# EAGLE design PowerIsoBoard_V1.2 (EAGLE 9.0.1)

## Sheet 1 of 4: Sensor dan power ISO
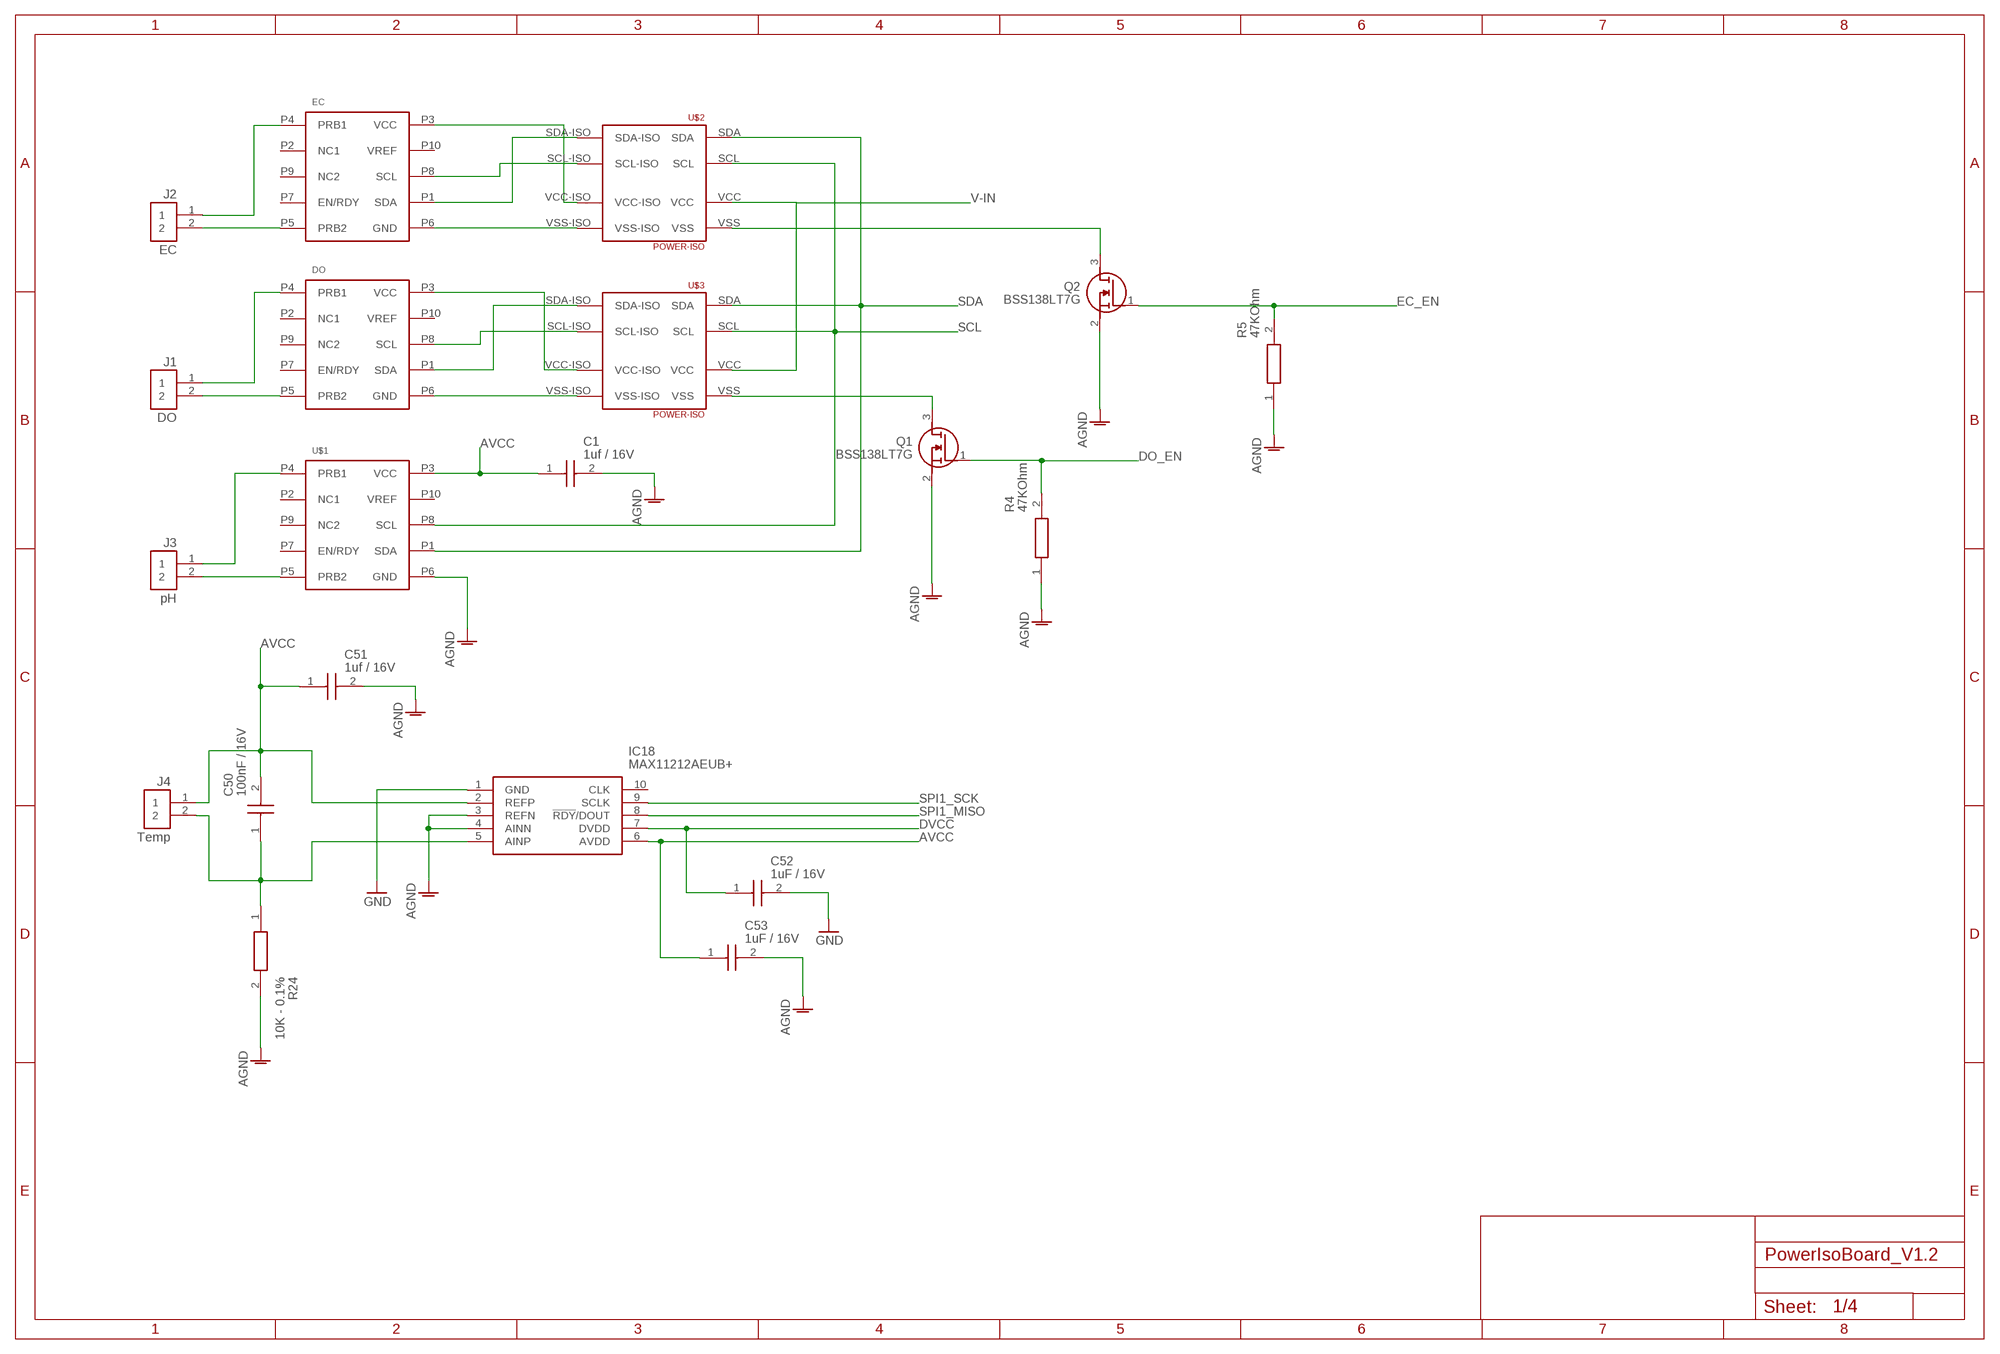
[diagram p0: schematic, sheet 1]

### Parts
C1  1uf / 16V  0603YC105JAT2A  [CAPC1608X90N]
C50  100nF / 16V  0603YC104JAT2A  [CAPC1608X90N]
C51  1uf / 16V  0603YC105JAT2A  [CAPC1608X90N]
C52  1uF / 16V  0603YC105JAT2A  [CAPC1608X90N]
C53  1uF / 16V  0603YC105JAT2A  [CAPC1608X90N]
DO  ATLAS-OEM-SMT  [EZO_SMT]
EC  ATLAS-OEM-SMT  [EZO_SMT]
IC18  MAX11212AEUB+  [SOP50P490X110-10N]
J1  DO  B2B-PH-K-S(LF)(SN)  [JST_B2B-PH-K-S(LF)(SN)]
J2  EC  B2B-PH-K-S(LF)(SN)  [JST_B2B-PH-K-S(LF)(SN)]
J3  pH  B2B-PH-K-S(LF)(SN)  [JST_B2B-PH-K-S(LF)(SN)]
J4  Temp  B2B-PH-K-S(LF)(SN)  [JST_B2B-PH-K-S(LF)(SN)]
Q1  BSS138LT7G  [SOT96P237X111-3N]
Q2  BSS138LT7G  [SOT96P237X111-3N]
R4  47KOhm  RC0603JR-1047KL  [RESC1608X55N]
R5  47KOhm  RC0603JR-1047KL  [RESC1608X55N]
R24  10K - 0.1%  ERA-3AEB103V  [RESC1608X55N]
U$1  ATLAS-OEM-SMT  [EZO_SMT]
U$2  POWER-ISO  [PWR_ISO_TH]
U$3  POWER-ISO  [PWR_ISO_TH]

### Nets
AGND: C1.2 Q1.2(S) Q2.2(S) R4.1 R5.1 U$1.P6(GND) ; also sheet 2
AVCC: C1.1 C50.2 C51.1 C53.1 IC18.2(REFP) IC18.6(AVDD) J4.1 U$1.P3(VCC) ; also sheet 2
DO_EN: Q1.1(G) R4.2 ; also sheet 3
DVCC: C52.1 IC18.7(DVDD) ; also sheet 2,3
EC_EN: Q2.1(G) R5.2 ; also sheet 3
GND: C51.2 C52.2 C53.2 IC18.1(GND) IC18.3(REFN) IC18.4(AINN) R24.2 ; supply symbol labelled AGND ; also sheet 2,3
N$1: C50.1 IC18.5(AINP) J4.2 R24.1
N$2: Q1.3(D) U$3.VSS
N$6: J3.2 U$1.P5(PRB2)
N$7: J3.1 U$1.P4(PRB1)
N$8: DO.P5(PRB2) J1.2
N$10: DO.P4(PRB1) J1.1
N$12: EC.P5(PRB2) J2.2
N$14: EC.P4(PRB1) J2.1
N$15: EC.P6(GND) U$2.VSS-ISO
N$16: EC.P3(VCC) U$2.VCC-ISO
N$17: EC.P8(SCL) U$2.SCL-ISO
N$18: EC.P1(SDA) U$2.SDA-ISO
N$19: DO.P6(GND) U$3.VSS-ISO
N$20: DO.P3(VCC) U$3.VCC-ISO
N$21: DO.P1(SDA) U$3.SDA-ISO
N$22: DO.P8(SCL) U$3.SCL-ISO
N$23: Q2.3(D) U$2.VSS
SCL: U$1.P8(SCL) U$2.SCL U$3.SCL ; also sheet 3
SDA: U$1.P1(SDA) U$2.SDA U$3.SDA ; also sheet 3
SPI1_MISO: IC18.8(!RDY!/DOUT) ; also sheet 3
SPI1_SCK: IC18.9(SCLK) ; also sheet 3
V-IN: U$2.VCC U$3.VCC ; also sheet 2,3
Unconnected: DO.P2(NC1) DO.P7(EN/RDY) DO.P9(NC2) DO.P10(VREF) EC.P2(NC1) EC.P7(EN/RDY) EC.P9(NC2) EC.P10(VREF) IC18.10(CLK) U$1.P2(NC1) U$1.P7(EN/RDY) U$1.P9(NC2) U$1.P10(VREF)

## Sheet 2 of 4: Regulator
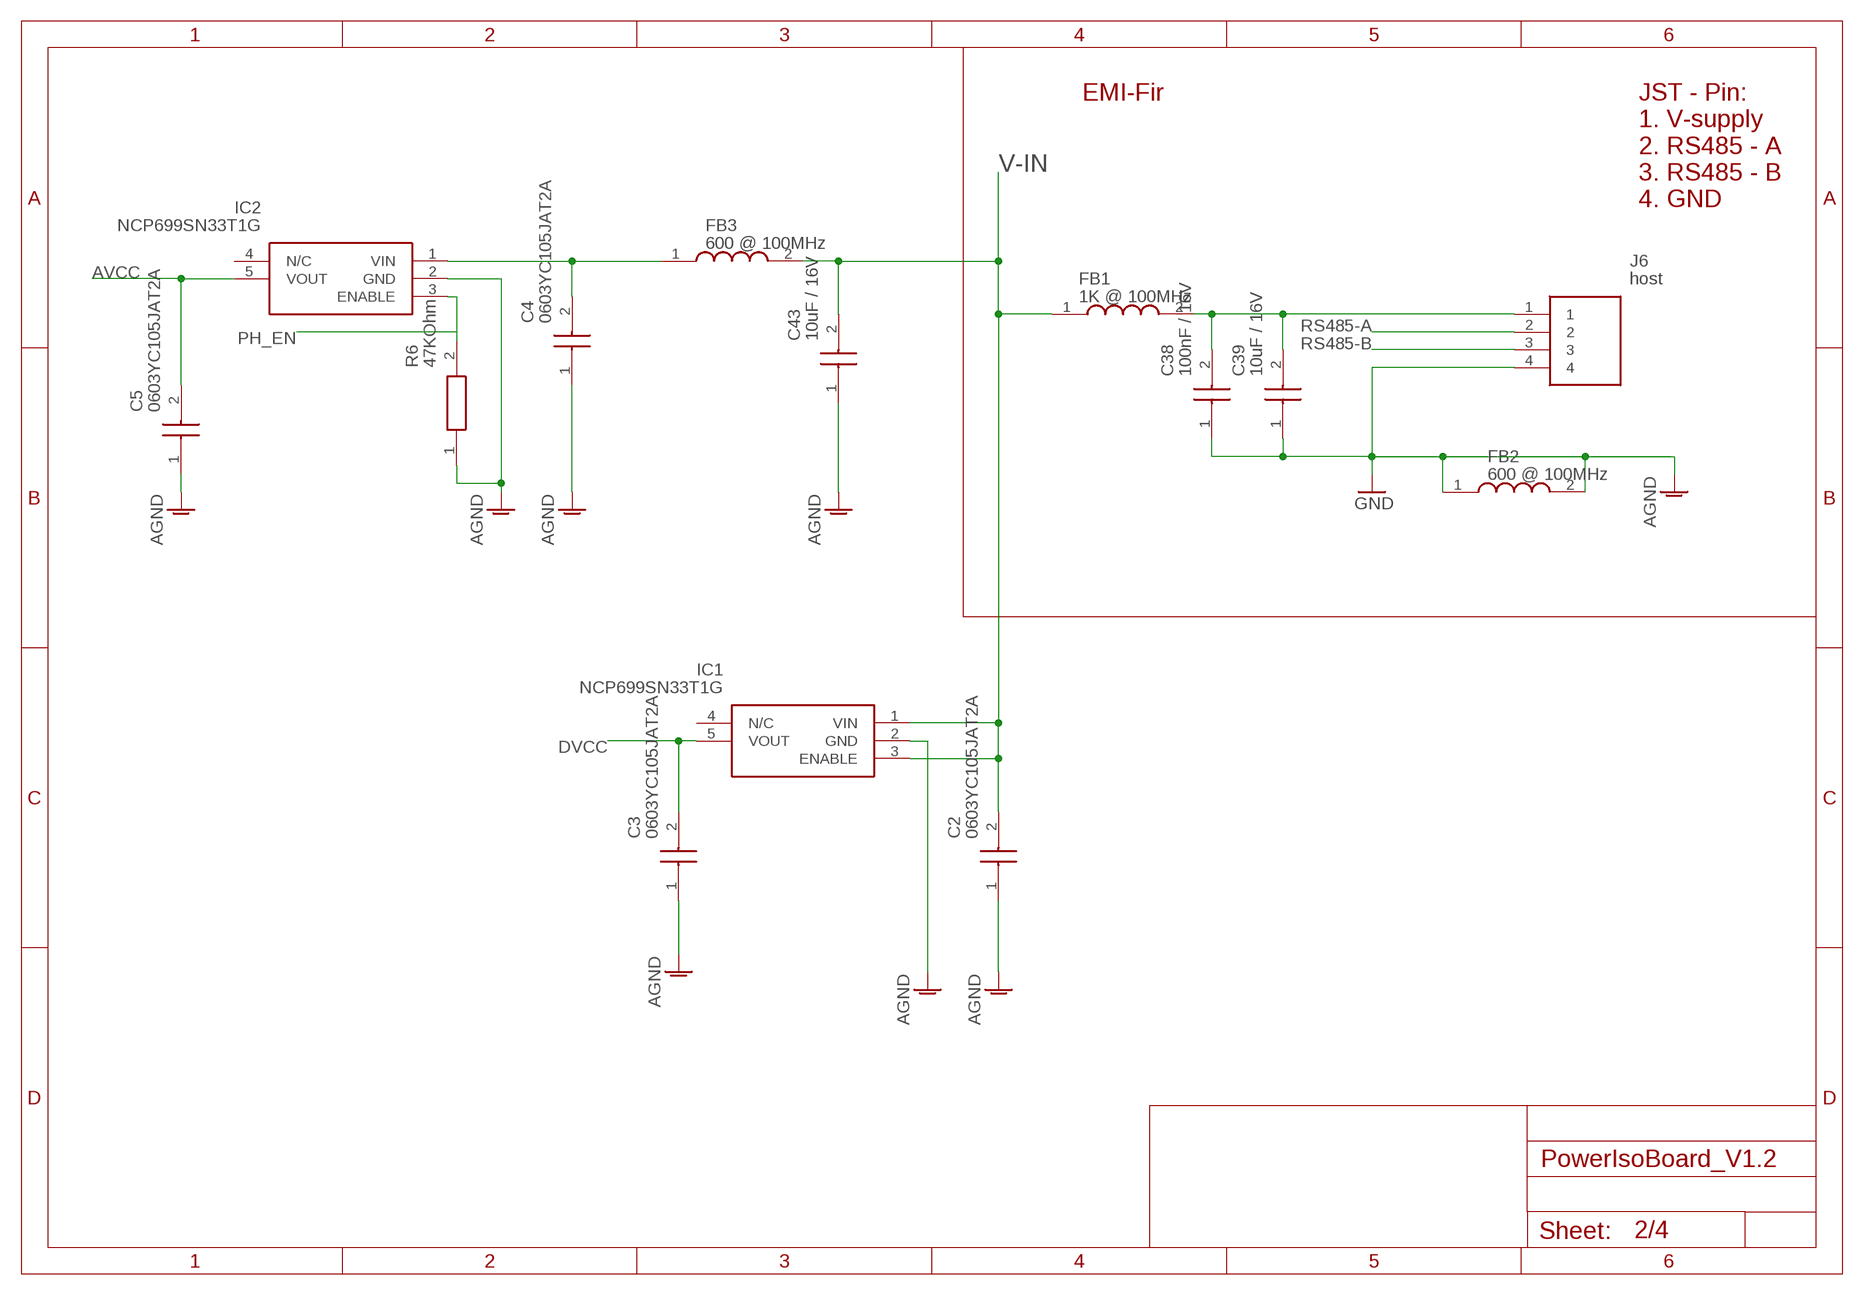
[diagram p1: schematic, sheet 2]

### Parts
C2  0603YC105JAT2A  [CAPC1608X90N]
C3  0603YC105JAT2A  [CAPC1608X90N]
C4  0603YC105JAT2A  [CAPC1608X90N]
C5  0603YC105JAT2A  [CAPC1608X90N]
C38  100nF / 16V  EMK107BJ104KAHT  [CAPC1608X90N]
C39  10uF / 16V  EMK107BBJ106MA-T  [CAPC1608X100N]
C43  10uF / 16V  EMK107BBJ106MA-T  [CAPC1608X100N]
FB1  1K @ 100MHz  BLM18KG102SH1D  [BLM18KG102SH1J]
FB2  600 @ 100MHz  MPZ1608S601ATA00  [BEADC1608X75N]
FB3  600 @ 100MHz  MPZ1608S601ATA00  [BEADC1608X75N]
IC1  NCP699SN33T1G  [SOT95P275X110-5N]
IC2  NCP699SN33T1G  [SOT95P275X110-5N]
J6  host  B4B-PH-K-S_LF__SN_  [SHDR4W50P0X200_1X4_990X450X600]
R6  47KOhm  RC0603JR-1047KL  [RESC1608X55N]

### Nets
AGND: C2.1 C3.1 C4.1 C5.1 C43.1 IC1.2(GND) IC2.2(GND) R6.1 ; also sheet 1
AVCC: C5.2 IC2.5(VOUT) ; also sheet 1
DVCC: C3.2 IC1.5(VOUT) ; also sheet 1,3
GND: C38.1 C39.1 FB2.1 FB2.2 J6.4 ; supply symbol labelled AGND ; also sheet 1,3
N$30: C38.2 C39.2 FB1.2 J6.1
N$31: C4.2 FB3.1 IC2.1(VIN)
PH_EN: IC2.3(ENABLE) R6.2 ; also sheet 3
RS485-A: J6.2 ; also sheet 3
RS485-B: J6.3 ; also sheet 3
V-IN: C2.2 C43.2 FB1.1 FB3.2 IC1.1(VIN) IC1.3(ENABLE) ; also sheet 1,3
Unconnected: IC1.4(N/C) IC2.4(N/C)

### Notes on the sheet
- EMI-Fir
- JST - Pin:
  1. V-supply
  2. RS485 - A
  3. RS485 - B
  4. GND

## Sheet 3 of 4
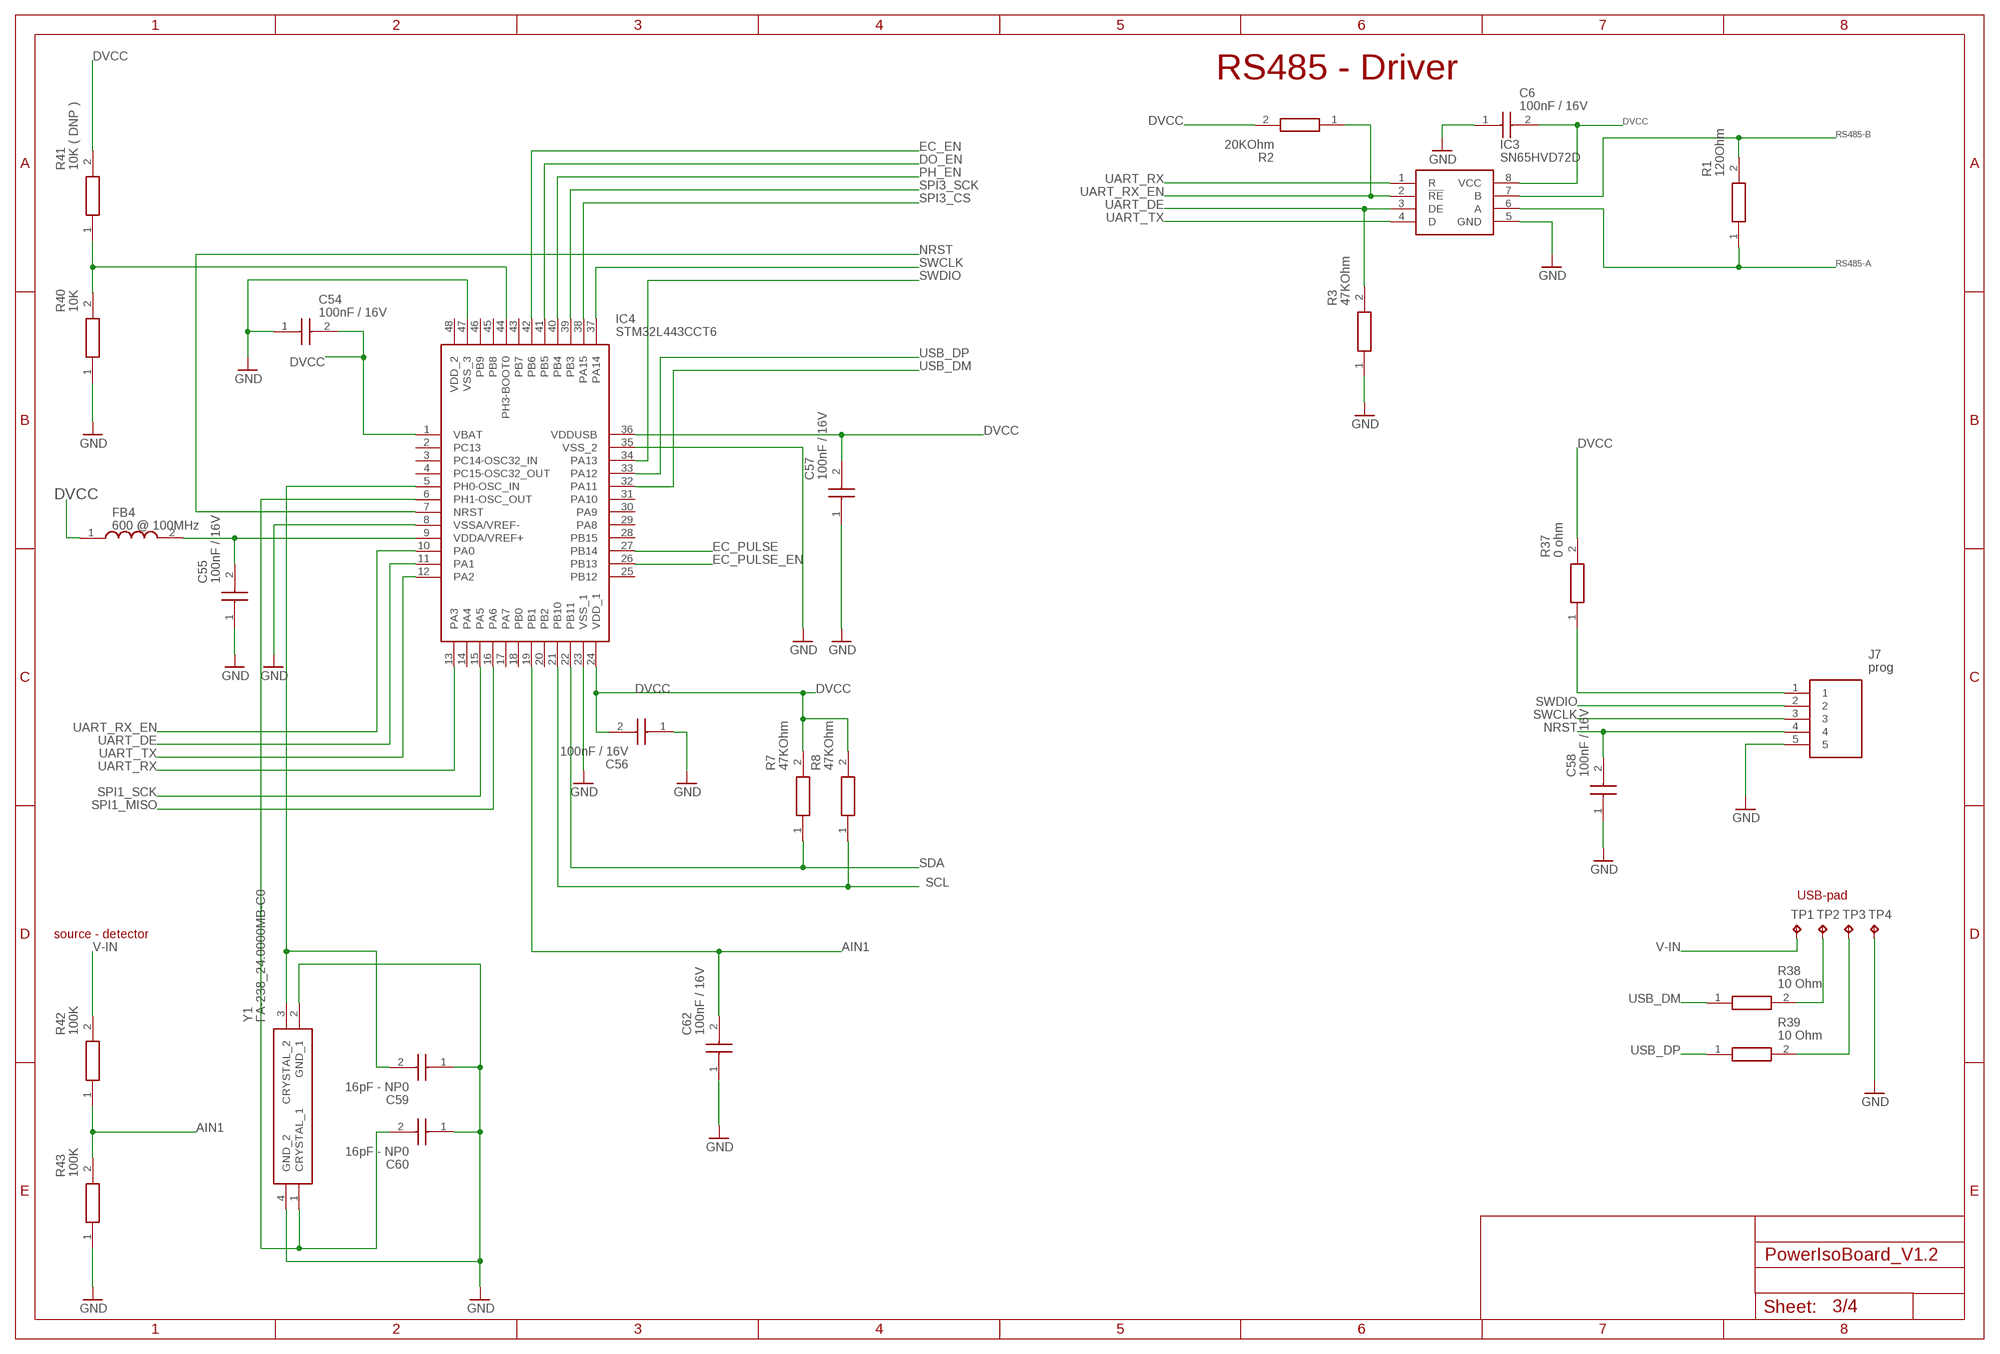
[diagram p2: schematic, sheet 3]

### Parts
C6  100nF / 16V  0603YC104JAT2A  [CAPC1608X90N]
C54  100nF / 16V  EMK107BJ104KAHT  [CAPC1608X90N]
C55  100nF / 16V  EMK107BJ104KAHT  [CAPC1608X90N]
C56  100nF / 16V  EMK107BJ104KAHT  [CAPC1608X90N]
C57  100nF / 16V  EMK107BJ104KAHT  [CAPC1608X90N]
C58  100nF / 16V  EMK107BJ104KAHT  [CAPC1608X90N]
C59  16pF - NP0  VJ0603A120KXCAC  [CAPC1608X97N]
C60  16pF - NP0  VJ0603A120KXCAC  [CAPC1608X97N]
C62  100nF / 16V  EMK107BJ104KAHT  [CAPC1608X90N]
FB4  600 @ 100MHz  MPZ1608S601ATA00  [BEADC1608X75N]
IC3  SN65HVD72D  [SOIC127P600X175-8N]
IC4  STM32L443CCT6  [QFP50P900X900X160-48N]
J7  prog  B5B-PH-K-S_LF__SN_  [SHDR5W50P0X200_1X5_1190X450X60]
R1  120Ohm  ERJ-3RBD1200V  [RESC1608X55N]
R2  20KOhm  ERA3AED203V  [RESC1608X55N]
R3  47KOhm  RC0603JR-1047KL  [RESC1608X55N]
R7  47KOhm  RC0603JR-1047KL  [RESC1608X55N]
R8  47KOhm  RC0603JR-1047KL  [RESC1608X55N]
R37  0 ohm  RC0603FR-070RL  [RESC1608X55N]
R38  10 Ohm  RT0603FRD0710RL  [RESC1608X55N]
R39  10 Ohm  RT0603FRD0710RL  [RESC1608X55N]
R40  10K  ERA-3AEB103V  [RESC1608X55N]
R41  10K ( DNP )  ERA-3AEB103V  [RESC1608X55N]
R42  100K  RT0603DRE07100KL  [RESC1608X55N]
R43  100K  RT0603DRE07100KL  [RESC1608X55N]
TP1  TPB1,27  [B1,27]
TP2  TPB1,27  [B1,27]
TP3  TPB1,27  [B1,27]
TP4  TPB1,27  [B1,27]
Y1  FA-238_24.0000MB-C0  [FA238240000MBC0]

### Nets
AIN1: C62.2 IC4.19(PB1) R42.1 R43.2
DO_EN: IC4.41(PB5) ; also sheet 1
DVCC: C6.2 C54.2 C56.2 C57.2 FB4.1 IC3.8(VCC) IC4.1(VBAT) IC4.24(VDD_1) IC4.36(VDDUSB) R2.2 R7.2 R8.2 R37.2 R41.2 ; also sheet 1,2
EC_EN: IC4.42(PB6) ; also sheet 1
EC_PULSE: IC4.27(PB14)
EC_PULSE_EN: IC4.26(PB13)
GND: C6.1 C54.1 C55.1 C56.1 C57.1 C58.1 C59.1 C60.1 C62.1 IC3.5(GND) IC4.8(VSSA/VREF-) IC4.23(VSS_1) IC4.35(VSS_2) IC4.47(VSS_3) J7.5 R3.1 R40.1 R43.1 TP4.TP Y1.2(GND_1) Y1.4(GND_2) ; also sheet 1,2
N$27: J7.1 R37.1
N$32: R38.2 TP2.TP
N$33: R39.2 TP3.TP
N$34: IC4.44(PH3-BOOT0) R40.2 R41.1
N$45: C60.2 IC4.6(PH1-OSC_OUT) Y1.1(CRYSTAL_1)
N$49: C59.2 IC4.5(PH0-OSC_IN) Y1.3(CRYSTAL_2)
N$52: C55.2 FB4.2 IC4.9(VDDA/VREF+)
NRST: C58.2 IC4.7(NRST) J7.4
PH_EN: IC4.40(PB4) ; also sheet 2
RS485-A: IC3.6(A) R1.1 ; also sheet 2
RS485-B: IC3.7(B) R1.2 ; also sheet 2
SCL: IC4.21(PB10) R8.1 ; also sheet 1
SDA: IC4.22(PB11) R7.1 ; also sheet 1
SPI1_MISO: IC4.16(PA6) ; also sheet 1
SPI1_SCK: IC4.15(PA5) ; also sheet 1
SPI3_CS: IC4.38(PA15)
SPI3_SCK: IC4.39(PB3)
SWCLK: IC4.37(PA14) J7.3
SWDIO: IC4.34(PA13) J7.2
UART_DE: IC3.3(DE) IC4.11(PA1) R3.2
UART_RX: IC3.1(R) IC4.13(PA3)
UART_RX_EN: IC3.2(!RE) IC4.10(PA0) R2.1
UART_TX: IC3.4(D) IC4.12(PA2)
USB_DM: IC4.32(PA11) R38.1
USB_DP: IC4.33(PA12) R39.1
V-IN: R42.2 TP1.TP ; also sheet 1,2
Unconnected: IC4.2(PC13) IC4.3(PC14-OSC32_IN) IC4.4(PC15-OSC32_OUT) IC4.14(PA4) IC4.17(PA7) IC4.18(PB0) IC4.20(PB2) IC4.25(PB12) IC4.28(PB15) IC4.29(PA8) IC4.30(PA9) IC4.31(PA10) IC4.43(PB7) IC4.45(PB8) IC4.46(PB9) IC4.48(VDD_2)

### Notes on the sheet
- RS485 - Driver
- USB-pad
- source - detector

## Sheet 4 of 4: Keterangan Update
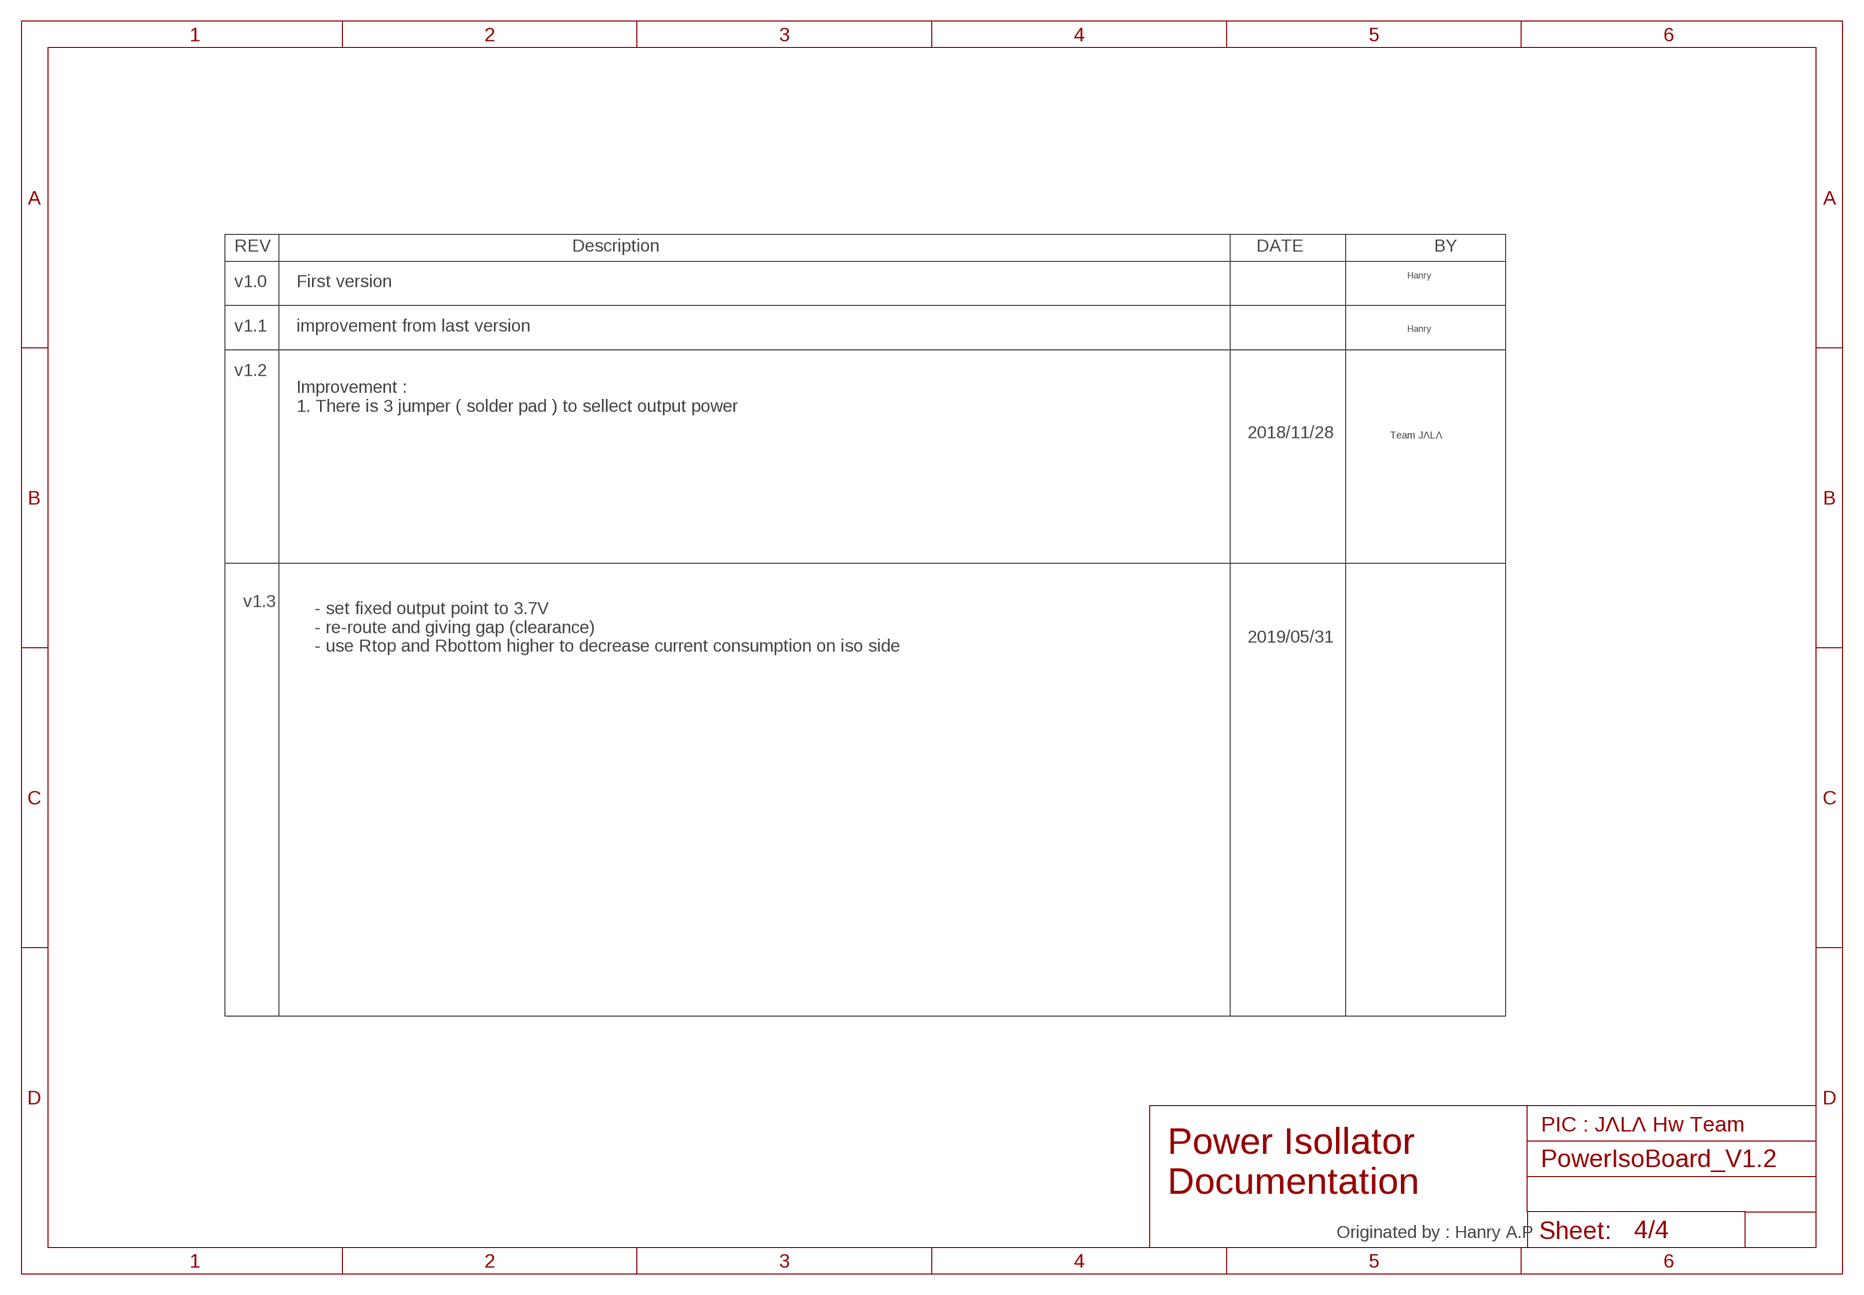
[diagram p3: schematic, sheet 4]

### Notes on the sheet
- Hanry
- v1.0 | First version
- v1.1 | improvement from last version | Hanry
- v1.2
- Improvement :
  1. There is 3 jumper ( solder pad ) to sellect output power
- 2018/11/28 | Team JΛLΛ
- v1.3
- 2019/05/31
- - set fixed output point to 3.7V
  - re-route and giving gap (clearance)
  - use Rtop and Rbottom higher to decrease current consumption on iso side
- PIC : JΛLΛ Hw Team
- Power Isollator
  Documentation
- Originated by : Hanry A.P

## Library data of the parts
C1-C5 C51-C53 = Samacsys:0603YC105JAT2A: Multilayer Ceramic Capacitors MLCC - SMD/SMT 16volts 1uF 5% X7R 0603 SIZE Source: Datasheet <http://www.mouser.com/catalog/supplier/library/pdf/AVXSurfaceMountCeramic.pdf>; ARROW_PART_NUMBER: 0603YC105JAT2A; ARROW_PRICE-STOCK: https://www.arrow.com/en/products/0603yc105jat2a/avx; DESCRIPTION: Multilayer Ceramic Capacitors MLCC - SMD/SMT 16volts 1uF 5% X7R 0603 SIZE; HEIGHT: 0.9mm; MANUFACTURER_NAME: AVX; MANUFACTURER_PART_NUMBER: 0603YC105JAT2A; MOUSER_PART_NUMBER: 581-0603YC105JAT2A; MOUSER_PRICE-STOCK: https://www.mouser.co.uk/ProductDetail/AVX/0603YC105JAT2A/?qs=RCLU9o6%252BptxSjO%252BNXwzoBQ%3D%3D
C6 C50 = Samacsys:0603YC104JAT2A: 0603 X7R ceramic capacitor, 100nF 16V AVX 0603 FlEXITERM 100nF Ceramic Multilayer Capacitor, 16 V dc X7R Dielectric ??5% SMD Source: Datasheet <http://datasheets.avx.com/X7RDielectric.pdf>; ARROW_PART_NUMBER: 0603YC104JAT2A; ARROW_PRICE-STOCK: https://www.arrow.com/en/products/0603yc104jat2a/avx; DESCRIPTION: 0603 X7R ceramic capacitor, 100nF 16V AVX 0603 FlEXITERM 100nF Ceramic Multilayer Capacitor, 16 V dc X7R Dielectric ??5% SMD; HEIGHT: 0.9mm; MANUFACTURER_NAME: AVX; MANUFACTURER_PART_NUMBER: 0603YC104JAT2A; MOUSER_PART_NUMBER: 581-0603YC104J; MOUSER_PRICE-STOCK: https://www.mouser.co.uk/ProductDetail/AVX/0603YC104JAT2A/?qs=sLCq1SyoLfFxJScN8MO4mA%3D%3D
C38 C54-C58 C62 = Samacsys:EMK107BJ104KAHT: Multilayer Ceramic Capacitors MLCC - SMD/SMT 0.1uF 16V X5R +/-10% 0603 AEC-Q200 Source: Datasheet <https://rs.componentsearchengine.com/Datasheets/1/EMK107BJ104KAHT.pdf>; DESCRIPTION: Multilayer Ceramic Capacitors MLCC - SMD/SMT 0.1uF 16V X5R +/-10% 0603 AEC-Q200; HEIGHT: 0.9mm; MANUFACTURER_NAME: TAIYO YUDEN; MANUFACTURER_PART_NUMBER: EMK107BJ104KAHT; MOUSER_PART_NUMBER: 963-EMK107BJ104KAHT; MOUSER_PRICE-STOCK: https://www.mouser.co.uk/ProductDetail/Taiyo-Yuden/EMK107BJ104KAHT?qs=CNQs48zzdnoELjxZCQMTEQ%3D%3D
C39 C43 = Samacsys:EMK107BBJ106MA-T: TAIYO YUDEN - EMK107BBJ106MA-T - CAPACITOR, MLCC, X5R, 10UF, 16V, 0603, REEL Source: Datasheet <https://altium.componentsearchengine.com/Datasheets/2/EMK107BBJ106MA-T.pdf>; DESCRIPTION: TAIYO YUDEN - EMK107BBJ106MA-T - CAPACITOR, MLCC, X5R, 10UF, 16V, 0603, REEL; HEIGHT: 1mm; MANUFACTURER_NAME: TAIYO YUDEN; MANUFACTURER_PART_NUMBER: EMK107BBJ106MA-T; MOUSER_PART_NUMBER: 963-EMK107BBJ106MA-T; MOUSER_PRICE-STOCK: https://www.mouser.co.uk/ProductDetail/Taiyo-Yuden/EMK107BBJ106MA-T?qs=%252BAZVS4b%2FkgLbAKVTp0R69Q%3D%3D
C59 C60 = Samacsys:VJ0603A120KXCAC: Multilayer Ceramic Capacitors MLCC - SMD/SMT Source: Datasheet <http://www.vishay.com/docs/45226/vj31xrohsautomlcc.pdf>; DESCRIPTION: Multilayer Ceramic Capacitors MLCC - SMD/SMT; HEIGHT: 0.97mm; MANUFACTURER_NAME: Vishay; MANUFACTURER_PART_NUMBER: VJ0603A120KXCAC; MOUSER_PART_NUMBER: N/A; MOUSER_PRICE-STOCK: https://www.mouser.co.uk/ProductDetail/Vishay-Vitramon/VJ0603A120KXCAC?qs=WQ%252BUh87gux%2F%2FnT6KKstV%252BA%3D%3D
DO EC U$1 = EZO:ATLAS-OEM-SMT; ATLAS-OEM: atlas-oem; ATLAS_OEM: Atlas - OEM
FB1 = Samacsys:BLM18KG102SH1D: BLM18_H1D Series EMI Suppression Filter 1000+/-25% at 100MHz 1A @85 Source: Datasheet <https://www.murata.com/en-us/products/productdetail?partno=BLM18KG102SH1#>; ARROW_PART_NUMBER: BLM18KG102SH1D; ARROW_PRICE-STOCK: https://www.arrow.com/en/products/blm18kg102sh1d/murata-manufacturing; DESCRIPTION: BLM18_H1D Series EMI Suppression Filter 1000+/-25% at 100MHz 1A @85; HEIGHT: 0.95mm; MANUFACTURER_NAME: Murata Electronics; MANUFACTURER_PART_NUMBER: BLM18KG102SH1D; MOUSER_PART_NUMBER: 81-BLM18KG102SH1D; MOUSER_PRICE-STOCK: https://www.mouser.co.uk/ProductDetail/Murata-Electronics/BLM18KG102SH1D?qs=0lQeLiL1qyYL39c9eT84hA%3D%3D
FB2-FB4 = Samacsys:MPZ1608S601ATA00: TDK - MPZ1608S601ATA00 - FERRITE BEAD, 0.15OHM, 1A, 0603 Source: Datasheet <https://componentsearchengine.com/Datasheets/2/MPZ1608S601ATA00.pdf>; ARROW_PART_NUMBER: MPZ1608S601ATA00; ARROW_PRICE-STOCK: https://www.arrow.com/en/products/mpz1608s601ata00/tdk; DESCRIPTION: TDK - MPZ1608S601ATA00 - FERRITE BEAD, 0.15OHM, 1A, 0603; HEIGHT: 0.75mm; MANUFACTURER_NAME: TDK; MANUFACTURER_PART_NUMBER: MPZ1608S601ATA00; MOUSER_PART_NUMBER: 810-MPZ1608S601ATA00; MOUSER_PRICE-STOCK: https://www.mouser.co.uk/ProductDetail/TDK/MPZ1608S601ATA00/?qs=47dIwT2ZIzth0CTKDYh9rw%3D%3D
IC1 IC2 = Samacsys:NCP699SN33T1G: ON SEMICONDUCTOR - NCP699SN33T1G - LDO VOLTAGE REGULATOR, 3.3V, 150mA, TSOP-5 Source: Datasheet <http://www.onsemi.com/pub/Collateral/NCP699-D.PDF>; ARROW_PART_NUMBER: NCP699SN33T1G; ARROW_PRICE-STOCK: https://www.arrow.com/en/products/ncp699sn33t1g/on-semiconductor; DESCRIPTION: ON SEMICONDUCTOR - NCP699SN33T1G - LDO VOLTAGE REGULATOR, 3.3V, 150mA, TSOP-5; HEIGHT: 1.1mm; MANUFACTURER_NAME: ON Semiconductor; MANUFACTURER_PART_NUMBER: NCP699SN33T1G; MOUSER_PART_NUMBER: 863-NCP699SN33T1G; MOUSER_PRICE-STOCK: https://www.mouser.co.uk/ProductDetail/ON-Semiconductor/NCP699SN33T1G?qs=mYaVSTb8pgUlwy5p82QNfw%3D%3D
IC3 = Samacsys:SN65HVD72D: 3.3 V Half-Duplex RS-485 with IEC ESD, 250 kbps Source: Datasheet <http://www.ti.com/lit/gpn/sn65hvd72>; ARROW_PART_NUMBER: SN65HVD72D; ARROW_PRICE-STOCK: https://www.arrow.com/en/products/sn65hvd72d/texas-instruments; DESCRIPTION: 3.3 V Half-Duplex RS-485 with IEC ESD, 250 kbps; HEIGHT: 1.75mm; MANUFACTURER_NAME: Texas Instruments; MANUFACTURER_PART_NUMBER: SN65HVD72D; MOUSER_PART_NUMBER: 595-SN65HVD72D; MOUSER_PRICE-STOCK: https://www.mouser.co.uk/ProductDetail/Texas-Instruments/SN65HVD72D/?qs=umApKWeh9pW%2FHHD2rvNVAg%3D%3D
IC4 = Samacsys:STM32L443CCT6: STMICROELECTRONICS - STM32L443CCT6 - ARM MCU, STM32 Family STM32L4 Series Microcontrollers, ARM Cortex-M4, 32bit, 80 MHz, 256 KB, 64 KB Source: Datasheet <https://componentsearchengine.com/Datasheets/2/STM32L443CCT6.pdf>; ARROW_PART_NUMBER: STM32L443CCT6; ARROW_PRICE-STOCK: https://www.arrow.com/en/products/stm32l443cct6/stmicroelectronics; DESCRIPTION: STMICROELECTRONICS - STM32L443CCT6 - ARM MCU, STM32 Family STM32L4 Series Microcontrollers, ARM Cortex-M4, 32bit, 80 MHz, 256 KB, 64 KB; HEIGHT: 1.6mm; MANUFACTURER_NAME: STMicroelectronics; MANUFACTURER_PART_NUMBER: STM32L443CCT6; MOUSER_PART_NUMBER: 511-STM32L443CCT6; MOUSER_PRICE-STOCK: https://www.mouser.co.uk/ProductDetail/STMicroelectronics/STM32L443CCT6/?qs=dTJS0cRn7ohLPtZ3IeJ%2Fbg%3D%3D
IC18 = Samacsys:MAX11212AEUB+: MAX11212AEUB+, 18 bit ADC Differential, Serial, 10-Pin uMAX Source: Datasheet <http://docs-emea.rs-online.com/webdocs/1253/0900766b812530b8.pdf>; DESCRIPTION: MAX11212AEUB+, 18 bit ADC Differential, Serial, 10-Pin uMAX; HEIGHT: 1.1mm; MANUFACTURER_NAME: Maxim Integrated; MANUFACTURER_PART_NUMBER: MAX11212AEUB+; MOUSER_PART_NUMBER: 700-MAX11212AEUB+; MOUSER_PRICE-STOCK: https://www.mouser.co.uk/ProductDetail/Maxim-Integrated/MAX11212AEUB%2b?qs=mzcOS1kGbgfUBSQ9RlyOlQ%3D%3D
J1-J4 = B2B-PH-K-S_LF__SN_:B2B-PH-K-S(LF)(SN): PH Series 2 Position 2 mm Pitch Through Hole Top Entry Shrouded Header Check prices <https://pricing.snapeda.com/parts/B2B-PH-K-S%28LF%29%28SN%29/JST%20Sales/view-part?ref=eda>; AVAILABILITY: Warning; DESCRIPTION: Connector Header Through Hole 2 position 0.079 (2.00mm); MF: JST Sales; MP: B2B-PH-K-S(LF)(SN); PACKAGE: None; PRICE: None
J6 = Samacsys:B4B-PH-K-S_LF__SN_: PH-2.0mm Header top entry 4 way JST PH Series, Series Number B4B, 2mm Pitch 4 Way 1 Row Straight PCB Header, Through Hole Termination, 2A Source: Datasheet <http://docs-emea.rs-online.com/webdocs/1347/0900766b81347511.pdf>; ARROW_PART_NUMBER: B4B-PH-K-S(LF)(SN); ARROW_PRICE-STOCK: https://www.arrow.com/en/products/b4b-ph-k-s-lf-sn/jst-manufacturing; DESCRIPTION: PH-2.0mm Header top entry 4 way JST PH Series, Series Number B4B, 2mm Pitch 4 Way 1 Row Straight PCB Header, Through Hole Termination, 2A; HEIGHT: 6mm; MANUFACTURER_NAME: JST (JAPAN SOLDERLESS TERMINALS); MANUFACTURER_PART_NUMBER: B4B-PH-K-S(LF)(SN)
J7 = Samacsys:B5B-PH-K-S_LF__SN_: PH-2.0mm Header top entry 5 way JST PH Series, Series Number B5B, 2mm Pitch 5 Way 1 Row Straight PCB Header, Through Hole Termination, 2A Source: Datasheet <http://uk.rs-online.com/web/p/products/8201438>; ARROW_PART_NUMBER: B5B-PH-K-S(LF)(SN); ARROW_PRICE-STOCK: https://www.arrow.com/en/products/b5b-ph-k-s-lf-sn/jst-manufacturing; DESCRIPTION: PH-2.0mm Header top entry 5 way JST PH Series, Series Number B5B, 2mm Pitch 5 Way 1 Row Straight PCB Header, Through Hole Termination, 2A; HEIGHT: 6mm; MANUFACTURER_NAME: JST (JAPAN SOLDERLESS TERMINALS); MANUFACTURER_PART_NUMBER: B5B-PH-K-S(LF)(SN)
Q1 Q2 = Samacsys:BSS138LT7G: MOSFET Single N-Channel Logic Level Power MOSFET 50V, 200mA, 3.5 Source: Datasheet <https://www.mouser.com/datasheet/2/308/BSS138LT1-D-1522521.pdf>; ARROW_PART_NUMBER: BSS138LT7G; ARROW_PRICE-STOCK: https://www.arrow.com/en/products/bss138lt7g/on-semiconductor; DESCRIPTION: MOSFET Single N-Channel Logic Level Power MOSFET 50V, 200mA, 3.5; HEIGHT: 1.11mm; MANUFACTURER_NAME: ON Semiconductor; MANUFACTURER_PART_NUMBER: BSS138LT7G; MOUSER_PART_NUMBER: 863-BSS138LT7G; MOUSER_PRICE-STOCK: https://www.mouser.co.uk/ProductDetail/ON-Semiconductor/BSS138LT7G/?qs=l7cgNqFNU1gVGpXKtqpwiw%3D%3D
R1 = Samacsys:ERJ-3RBD1200V: ERJ3R Resistor,0.1W,120 Ohms,0.5% Panasonic Thick Film Surface Mount Resistor 0603 Case 120 +/-0.5% 0.1W +/-50ppm/C Source: Datasheet <http://docs-europe.electrocomponents.com/webdocs/13ba/0900766b813ba21b.pdf>; DESCRIPTION: ERJ3R Resistor,0.1W,120 Ohms,0.5% Panasonic Thick Film Surface Mount Resistor 0603 Case 120 +/-0.5% 0.1W +/-50ppm/C; HEIGHT: 0.55mm; MANUFACTURER_NAME: Panasonic; MANUFACTURER_PART_NUMBER: ERJ-3RBD1200V; MOUSER_PART_NUMBER: 667-ERJ-3RBD1200V; MOUSER_PRICE-STOCK: https://www.mouser.co.uk/ProductDetail/Panasonic/ERJ-3RBD1200V/?qs=KTDjhDDUMAn3RR1z5n7W4A%3D%3D
R2 = Samacsys:ERA3AED203V: Metal Film (Thin Film) Chip Resistor 0603 203 Source: Datasheet <https://industrial.panasonic.com/cdbs/www-data/pdf/RDM0000/AOA0000C307.pdf>; ARROW_PART_NUMBER: ERA3AED203V; ARROW_PRICE-STOCK: https://www.arrow.com/en/products/era-3aed203v/panasonic; DESCRIPTION: Metal Film (Thin Film) Chip Resistor 0603 203; HEIGHT: 0.55mm; MANUFACTURER_NAME: Panasonic; MANUFACTURER_PART_NUMBER: ERA3AED203V
R3-R8 = Samacsys:RC0603JR-1047KL: YAGEO - RC0603JR-1047KL - RES, THICK FILM, 47K, 5%, 0.1W, 0603 Source: Datasheet <http://www.yageo.com/documents/recent/PYu-RC0603_51_RoHS_L_v5.pdf>; ARROW_PART_NUMBER: RC0603JR-1047KL; ARROW_PRICE-STOCK: https://www.arrow.com/en/products/rc0603jr-1047kl/yageo; DESCRIPTION: YAGEO - RC0603JR-1047KL - RES, THICK FILM, 47K, 5%, 0.1W, 0603; HEIGHT: 0.55mm; MANUFACTURER_NAME: YAGEO (PHYCOMP); MANUFACTURER_PART_NUMBER: RC0603JR-1047KL; MOUSER_PART_NUMBER: 603-RC0603JR-1047KL; MOUSER_PRICE-STOCK: https://www.mouser.co.uk/ProductDetail/Yageo/RC0603JR-1047KL/?qs=fRxXYNj8ftFCH6obQ4GdBw%3D%3D
R24 R40 R41 = Samacsys:ERA-3AEB103V: Thin Film Resistors - SMD 0603 1/10W 10Kohms 0.1% 25ppm Source: Datasheet <https://industrial.panasonic.com/cdbs/www-data/pdf/RDM0000/AOA0000C307.pdf>; ARROW_PART_NUMBER: ERA-3AEB103V; ARROW_PRICE-STOCK: https://www.arrow.com/en/products/era-3aeb103v/panasonic; DESCRIPTION: Thin Film Resistors - SMD 0603 1/10W 10Kohms 0.1% 25ppm; HEIGHT: 0.55mm; MANUFACTURER_NAME: Panasonic; MANUFACTURER_PART_NUMBER: ERA-3AEB103V; MOUSER_PART_NUMBER: 667-ERA-3AEB103V; MOUSER_PRICE-STOCK: https://www.mouser.co.uk/ProductDetail/Panasonic/ERA-3AEB103V/?qs=1VWA5LkbEaprA2zo9bMIGA%3D%3D
R37 = Samacsys:RC0603FR-070RL: YAGEO - RC0603FR-070RL - RESISTOR, THICK FILM, 0 OHM, 100MW, 1% Source: Datasheet <https://eu.mouser.com/datasheet/2/447/PYu-RC_Group_51_RoHS_L_10-1664068.pdf>; ARROW_PART_NUMBER: RC0603FR-070RL; ARROW_PRICE-STOCK: https://www.arrow.com/en/products/rc0603fr-070rl/yageo; DESCRIPTION: YAGEO - RC0603FR-070RL - RESISTOR, THICK FILM, 0 OHM, 100MW, 1%; HEIGHT: 0.55mm; MANUFACTURER_NAME: YAGEO (PHYCOMP); MANUFACTURER_PART_NUMBER: RC0603FR-070RL; MOUSER_PART_NUMBER: 603-RC0603FR-070RL; MOUSER_PRICE-STOCK: https://www.mouser.co.uk/ProductDetail/Yageo/RC0603FR-070RL/?qs=0yPvnVz5%2FmpDQv43TwvCfw%3D%3D
R38 R39 = Samacsys:RT0603FRD0710RL: Thin Film Resistors,10 Ohms,25 PPM / C,100 mW (1/10 W) Source: Datasheet <http://www.yageo.com/documents/recent/PYu-RT_1-to-0.01_RoHS_L_11.pdf>; DESCRIPTION: Thin Film Resistors,10 Ohms,25 PPM / C,100 mW (1/10 W); HEIGHT: 0.55mm; MANUFACTURER_NAME: YAGEO (PHYCOMP); MANUFACTURER_PART_NUMBER: RT0603FRD0710RL; MOUSER_PART_NUMBER: 603-RT0603FRD0710RL; MOUSER_PRICE-STOCK: https://www.mouser.co.uk/ProductDetail/Yageo/RT0603FRD0710RL/?qs=k2KEx2DUIRT6hVLH%252BBT1HQ%3D%3D
R42 R43 = Samacsys:RT0603DRE07100KL: Thin Film Resistors - SMD 100K OHM .5% 50PPM 0603 Source: Datasheet <https://mouser.componentsearchengine.com/Datasheets/1/RT0603DRE07100KL.pdf>; ARROW_PART_NUMBER: RT0603DRE07100KL; ARROW_PRICE-STOCK: https://www.arrow.com/en/products/rt0603dre07100kl/yageo; DESCRIPTION: Thin Film Resistors - SMD 100K OHM .5% 50PPM 0603; HEIGHT: 0.55mm; MANUFACTURER_NAME: YAGEO (PHYCOMP); MANUFACTURER_PART_NUMBER: RT0603DRE07100KL; MOUSER_PART_NUMBER: 603-RT0603DRE07100KL; MOUSER_PRICE-STOCK: https://www.mouser.co.uk/ProductDetail/Yageo/RT0603DRE07100KL/?qs=qk16NiFnx93EdzBTUxxC1w%3D%3D
TP1-TP4 = testpad:TP: Test pad
U$2 U$3 = EZO:POWER-ISO
Y1 = Samacsys:FA-238_24.0000MB-C0: Crystals SMD XTAL MHZ +/-10PPM+/-30PPM-40~85C 10.0PF 250TR Source: Datasheet <https://www.arrow.com/en/products/fa-23824.0000mb-c0/epson-electronics-america>; ARROW_PART_NUMBER: FA-238 24.0000MB-C0; ARROW_PRICE-STOCK: https://www.arrow.com/en/products/fa-23824.0000mb-c0/epson-electronics-america; DESCRIPTION: Crystals SMD XTAL MHZ +/-10PPM+/-30PPM-40~85C 10.0PF 250TR; HEIGHT: 0.7mm; MANUFACTURER_NAME: Epson Timing; MANUFACTURER_PART_NUMBER: FA-238 24.0000MB-C0; MOUSER_PART_NUMBER: 732-FA-23824MB-C0; MOUSER_PRICE-STOCK: https://www.mouser.co.uk/ProductDetail/Epson-Timing/FA-238-240000MB-C0/?qs=f9yNj16SXrKB4%252B1u12l6Ew%3D%3D

## Net classes
1 power: width 0.61 mm, drill 0.406 mm, clearance 0.203 mm
2 gnd: width 0.305 mm, drill 0.406 mm, clearance 0.203 mm
3 power usb: width 0.508 mm, drill 0.406 mm, clearance 0.203 mm

## Board
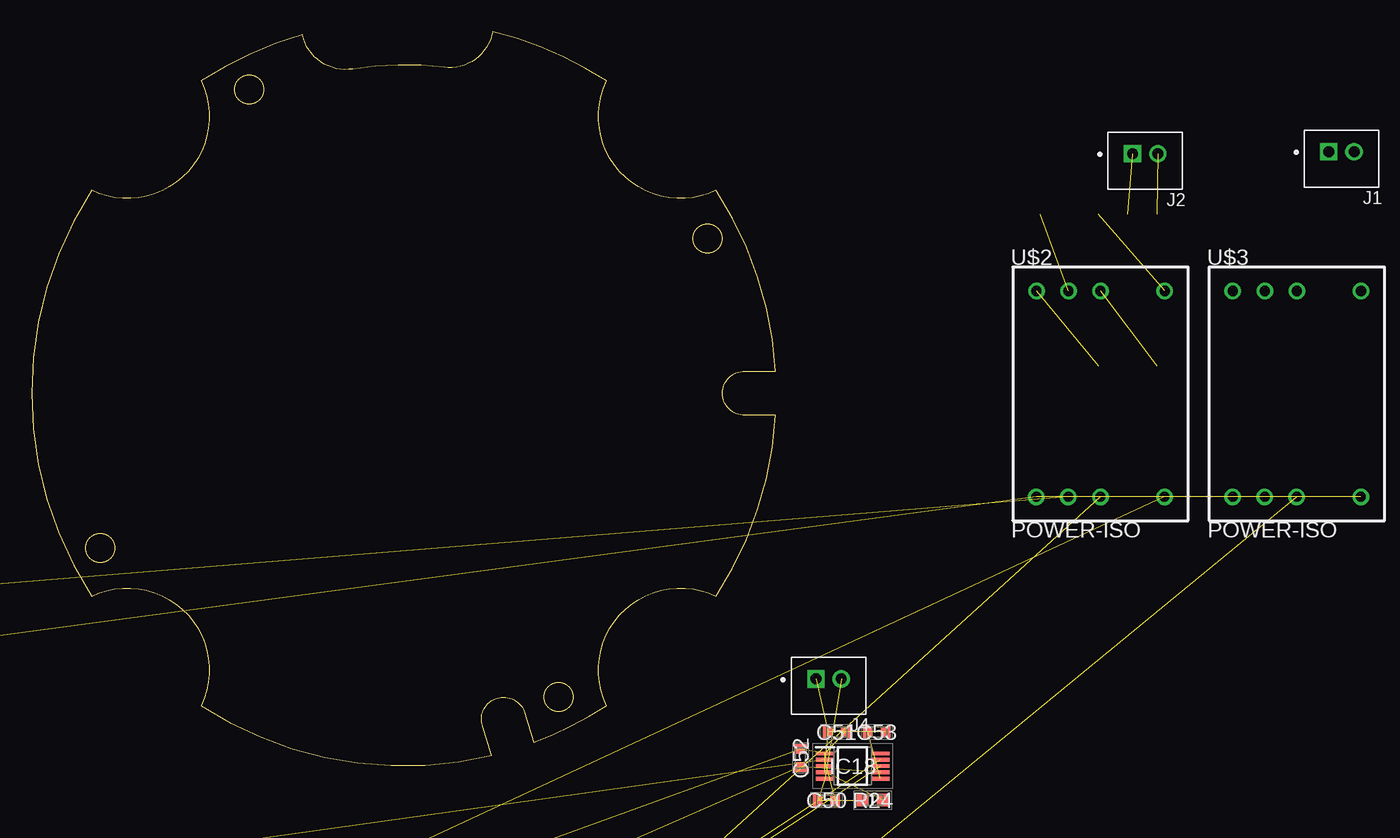
[diagram p4: board, top side]
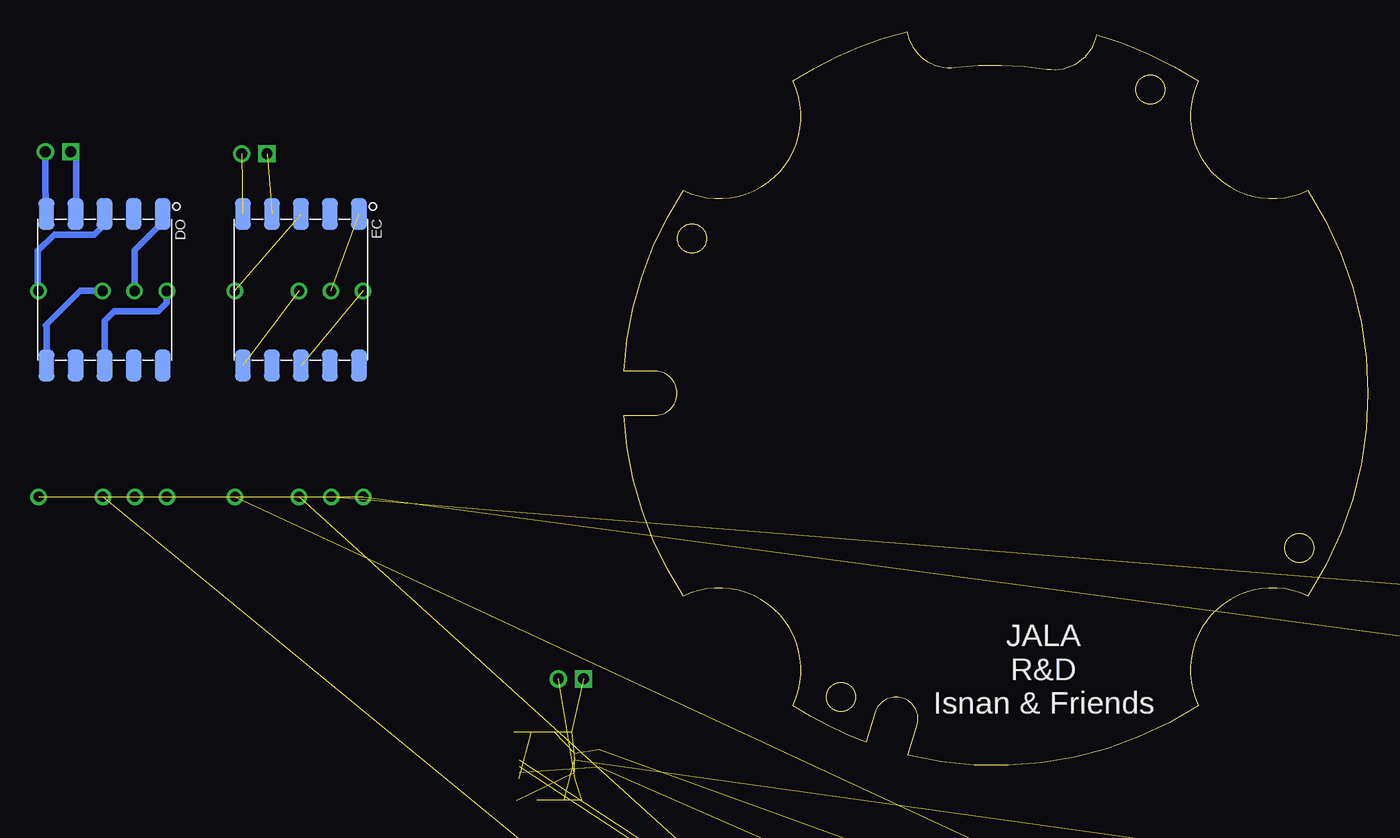
[diagram p5: board, bottom side, seen from below]

Size 58.95 x 58.13 mm. Coordinates in mm from the lower left corner, seen from the top.
Outline: 25.43,55.16 arc-87 21.47,57.87 arc17 13.43,54.23 arc-141 4.76,45.55 arc66 4.76,13.42 arc-141 13.43,4.74 arc47 36.44,0.81 35.72,3.15 arc-180 39.07,4.18 39.78,1.83 arc13 45.56,4.74 arc-141 54.24,13.42 arc30 58.95,27.73 56.5,27.73 arc-180 56.5,31.23 58.95,31.23 arc30 54.24,45.55 arc-141 45.56,54.23 arc19 36.54,58.13 arc-87 32.67,55.29 arc16 25.43,55.16
Outline: circle at 5.44,17.23 radius 1.15
Outline: circle at 53.56,41.74 radius 1.15
Outline: circle at 41.76,5.43 radius 1.15
Outline: circle at 17.24,53.54 radius 1.15
Copper layers (1*16): Top 0.035mm / dielectric 1.5mm / Bottom 0.035mm
Design rules "SeeedStudio_2layer_DRU_no_angle_20140221": minimum track width 6mil, minimum drill 12mil, track to track 6mil, track to pad 6mil, pad to pad 6mil, via to via 6mil, smd to smd 0mil, copper to edge 10mil, drill to drill 10mil, minimum pad ring 10mil, minimum via ring 6mil, stop-mask expansion 2mil, vias tented up to drill 100mil, thermal gap 10mil

### Footprints (pad centres in the part's own frame; a part is rotated, then mirrored left to right if it is on the bottom)
CAPC1608X90N = smd 0.75 x 0.94: 1 -0.7,0; 2 0.7,0
CAPC1608X100N = smd 0.87 x 1.02: 1 -0.68,0; 2 0.68,0
CAPC1608X97N = smd 0.78 x 0.98: 1 -0.7,0; 2 0.7,0
EZO_SMT = smd 2.54 x 1.27: P1 -6.1,4.8; P2 -6.1,2.5; P3 -6.1,0.2; P4 -6.1,-2.1; P5 -6.1,-4.4; P6 5.9,-4.4; P7 5.9,-2.1; P8 5.9,0.2; P9 5.9,2.5; P10 5.9,4.8
BLM18KG102SH1J = smd 0.65 x 0.7: 1 -0.675,0; 2 0.675,0
BEADC1608X75N = smd 0.9 x 1: 1 -0.8,0; 2 0.8,0
SOT95P275X110-5N = smd 1.25 x 0.6: 1 -1.25,0.95; 2 -1.25,0; 3 -1.25,-0.95; 4 1.25,-0.95; 5 1.25,0.95
SOIC127P600X175-8N = smd 1.528 x 0.65: 1 -2.711,1.905; 2 -2.711,0.635; 3 -2.711,-0.635; 4 -2.711,-1.905; 5 2.711,-1.905; 6 2.711,-0.635; 7 2.711,0.635; 8 2.711,1.905
QFP50P900X900X160-48N = smd 1.475 x 0.3: 1 -4.238,2.75; 2 -4.238,2.25; 3 -4.238,1.75; 4 -4.238,1.25; 5 -4.238,0.75; 6 -4.238,0.25; 7 -4.238,-0.25; 8 -4.238,-0.75; 9 -4.238,-1.25; 10 -4.238,-1.75; 11 -4.238,-2.25; 12 -4.238,-2.75; 25 4.238,-2.75; 26 4.238,-2.25; 27 4.238,-1.75; 28 4.238,-1.25; 29 4.238,-0.75; 30 4.238,-0.25; 31 4.238,0.25; 32 4.238,0.75; 33 4.238,1.25; 34 4.238,1.75; 35 4.238,2.25; 36 4.238,2.75 | smd 0.3 x 1.475: 13 -2.75,-4.238; 14 -2.25,-4.238; 15 -1.75,-4.238; 16 -1.25,-4.238; 17 -0.75,-4.238; 18 -0.25,-4.238; 19 0.25,-4.238; 20 0.75,-4.238; 21 1.25,-4.238; 22 1.75,-4.238; 23 2.25,-4.238; 24 2.75,-4.238; 37 2.75,4.238; 38 2.25,4.238; 39 1.75,4.238; 40 1.25,4.238; 41 0.75,4.238; 42 0.25,4.238; 43 -0.25,4.238; 44 -0.75,4.238; 45 -1.25,4.238; 46 -1.75,4.238; 47 -2.25,4.238; 48 -2.75,4.238
SOP50P490X110-10N = smd 1.4 x 0.3: 1 -2.2,1; 2 -2.2,0.5; 3 -2.2,0; 4 -2.2,-0.5; 5 -2.2,-1; 6 2.2,-1; 7 2.2,-0.5; 8 2.2,0; 9 2.2,0.5; 10 2.2,1
JST_B2B-PH-K-S(LF)(SN) = drill 0.86 square: 1 1,-0.55 | drill 0.86: 2 -1,-0.55
SHDR4W50P0X200_1X4_990X450X600 = drill 0.9 pad 1.35 square: 1 0,0 | drill 0.9 pad 1.35: 2 -2,0; 3 -4,0; 4 -6,0
SHDR5W50P0X200_1X5_1190X450X60 = drill 0.9 pad 1.35 square: 1 0,0 | drill 0.9 pad 1.35: 2 -2,0; 3 -4,0; 4 -6,0; 5 -8,0
SOT96P237X111-3N = smd 1.25 x 0.6: 1 -1.05,0.955; 2 -1.05,-0.955; 3 1.05,0
RESC1608X55N = smd 0.9 x 1: 1 -0.8,0; 2 0.8,0
B1,27 = smd 1.27 x 1.27: TP 0,0
PWR_ISO_TH = drill 0.8: SCL 2.01,1.95; SCL-ISO 2.02,18.26; SDA 4.55,1.95; SDA-ISO 4.56,18.26; VCC 12.17,1.95; VCC-ISO 12.18,18.26; VSS 7.09,1.95; VSS-ISO 7.1,18.26
FA238240000MBC0 = smd 1.4 x 1.2: 1 -1.1,-0.8; 2 1.1,-0.8; 3 1.1,0.8; 4 -1.1,0.8

### Placement (x,y rotation side)
C1  2.04,-8.14 0 top  (outside the outline)
C2  -69.24,-61.32 0 top  (outside the outline)
C3  -73.21,-64.5 0 top  (outside the outline)
C4  -77.18,-67.67 0 top  (outside the outline)
C5  -81.15,-70.85 0 top  (outside the outline)
C6  -66.07,-119.27 0 top  (outside the outline)
C38  -59.88,-50.53 0 top  (outside the outline)
C39  -51.3,-39.57 0 top  (outside the outline)
C43  -60.35,-43.7 0 top  (outside the outline)
C50  63,-2.74 0 top  (outside the outline)
C51  63.79,2.65 0 top  (outside the outline)
C52  60.93,0.59 90 top
C53  66.96,2.65 0 top  (outside the outline)
C54  -86.39,-122.6 0 top  (outside the outline)
C55  -75.59,-122.6 0 top  (outside the outline)
C56  -64.8,-122.6 0 top  (outside the outline)
C57  -86.39,-125.77 0 top  (outside the outline)
C58  -75.59,-125.77 0 top  (outside the outline)
C59  -86.71,-119.27 0 top  (outside the outline)
C60  -76.55,-119.27 0 top  (outside the outline)
C62  -64.8,-125.77 0 top  (outside the outline)
DO  100.3,37.58 270 bottom  (outside the outline)
EC  84.74,37.58 270 bottom  (outside the outline)
FB1  -60.67,-39.89 0 top  (outside the outline)
FB2  -85.12,-74.18 0 top  (outside the outline)
FB3  -58.45,-47.19 0 top  (outside the outline)
FB4  -74.32,-108.47 0 top  (outside the outline)
IC1  -61.31,-54.02 0 top  (outside the outline)
IC2  -65.27,-57.83 0 top  (outside the outline)
IC3  -69.88,-92.75 0 top  (outside the outline)
IC4  -84.01,-95.77 0 top  (outside the outline)
IC18  65.06,-0.04 0 top  (outside the outline)
J1  103.79,48.06 180 top  (outside the outline)
J2  88.24,47.9 180 top  (outside the outline)
J3  -53.84,4.08 0 top  (outside the outline)
J4  63.15,6.31 180 top  (outside the outline)
J6  -52.1,-30.68 0 top  (outside the outline)
J7  -76.7,-82.91 0 top  (outside the outline)
Q1  -87.98,-132.44 0 top  (outside the outline)
Q2  -90.04,-136.09 0 top  (outside the outline)
R1  -71.78,-112.6 0 top  (outside the outline)
R2  -87.82,-112.6 0 top  (outside the outline)
R3  -79.72,-112.6 0 top  (outside the outline)
R4  -91.94,-139.59 0 top  (outside the outline)
R5  -91.94,-142.92 0 top  (outside the outline)
R6  -91.94,-146.25 0 top  (outside the outline)
R7  -92.1,-149.59 0 top  (outside the outline)
R8  -92.1,-152.92 0 top  (outside the outline)
R24  66.65,-2.74 0 top  (outside the outline)
R37  -81.47,-115.93 0 top  (outside the outline)
R38  -64.16,-112.6 0 top  (outside the outline)
R39  -88.13,-115.93 0 top  (outside the outline)
R40  -65.91,-115.93 0 top  (outside the outline)
R41  -62.26,-108.47 0 top  (outside the outline)
R42  -75.91,-115.93 0 top  (outside the outline)
R43  -70.67,-115.93 0 top  (outside the outline)
TP1  -66.07,-104.5 0 top  (outside the outline)
TP2  -60.67,-104.5 0 top  (outside the outline)
TP3  -89.72,-109.58 0 top  (outside the outline)
TP4  -84.32,-109.58 0 top  (outside the outline)
U$1  -36.54,6.31 0 top  (outside the outline)
U$2  77.6,19.32 0 top  (outside the outline)
U$3  93.16,19.32 0 top  (outside the outline)
Y1  -80.04,-103.87 0 top  (outside the outline)

### Tracks (layer width: path | path; a pad name or v marks a point on that pad's centre or on a via)
AGND  (13 unrouted)
AIN1  (3 unrouted)
AVCC  (9 unrouted)
DO_EN  (2 unrouted)
DVCC  (17 unrouted)
EC_EN  (2 unrouted)
GND  (32 unrouted)
N$1  (3 unrouted)
N$2  (1 unrouted)
N$6  (1 unrouted)
N$7  (1 unrouted)
N$8
  Bottom 0.508: J1.2 104.79,45.68 DO.P5
N$10
  Bottom 0.508: J1.1 102.79,48.49 102.37,48.06 102.37,45.62 DO.P4
N$12  (1 unrouted)
N$14  (1 unrouted)
N$15  (1 unrouted)
N$16  (1 unrouted)
N$17  (1 unrouted)
N$18  (1 unrouted)
N$19
  Bottom 0.508: U$3.VSS-ISO 102.04,37.58 104.75,34.88 104.7,34.84 DO.P6
N$20
  Bottom 0.508: DO.P3 100.1,42.86 100.94,42.02 104.11,42.02 105.38,40.75 105.38,37.63 U$3.VCC-ISO
N$21
  Bottom 0.508: DO.P1 95.5,43.01 97.72,40.8 U$3.SDA-ISO
N$22
  Bottom 0.508: U$3.SCL-ISO 95.18,36.67 95.86,35.99 99.35,35.99 100.1,35.24 DO.P8
N$23  (1 unrouted)
N$27  (1 unrouted)
N$30  (3 unrouted)
N$31  (2 unrouted)
N$32  (1 unrouted)
N$33  (1 unrouted)
N$34  (2 unrouted)
N$45  (2 unrouted)
N$49  (2 unrouted)
N$52  (2 unrouted)
NRST  (2 unrouted)
PH_EN  (2 unrouted)
RS485-A  (2 unrouted)
RS485-B  (2 unrouted)
SCL  (4 unrouted)
SDA  (4 unrouted)
SPI1_MISO  (1 unrouted)
SPI1_SCK  (1 unrouted)
SWCLK  (1 unrouted)
SWDIO  (1 unrouted)
UART_DE  (2 unrouted)
UART_RX  (1 unrouted)
UART_RX_EN  (2 unrouted)
UART_TX  (1 unrouted)
USB_DM  (1 unrouted)
USB_DP  (1 unrouted)
V-IN  (9 unrouted)

### Text on the board
bNames: JALA / R&D / Isnan & Friends